# EAGLE design HarvestRing (EAGLE 6.5.0)
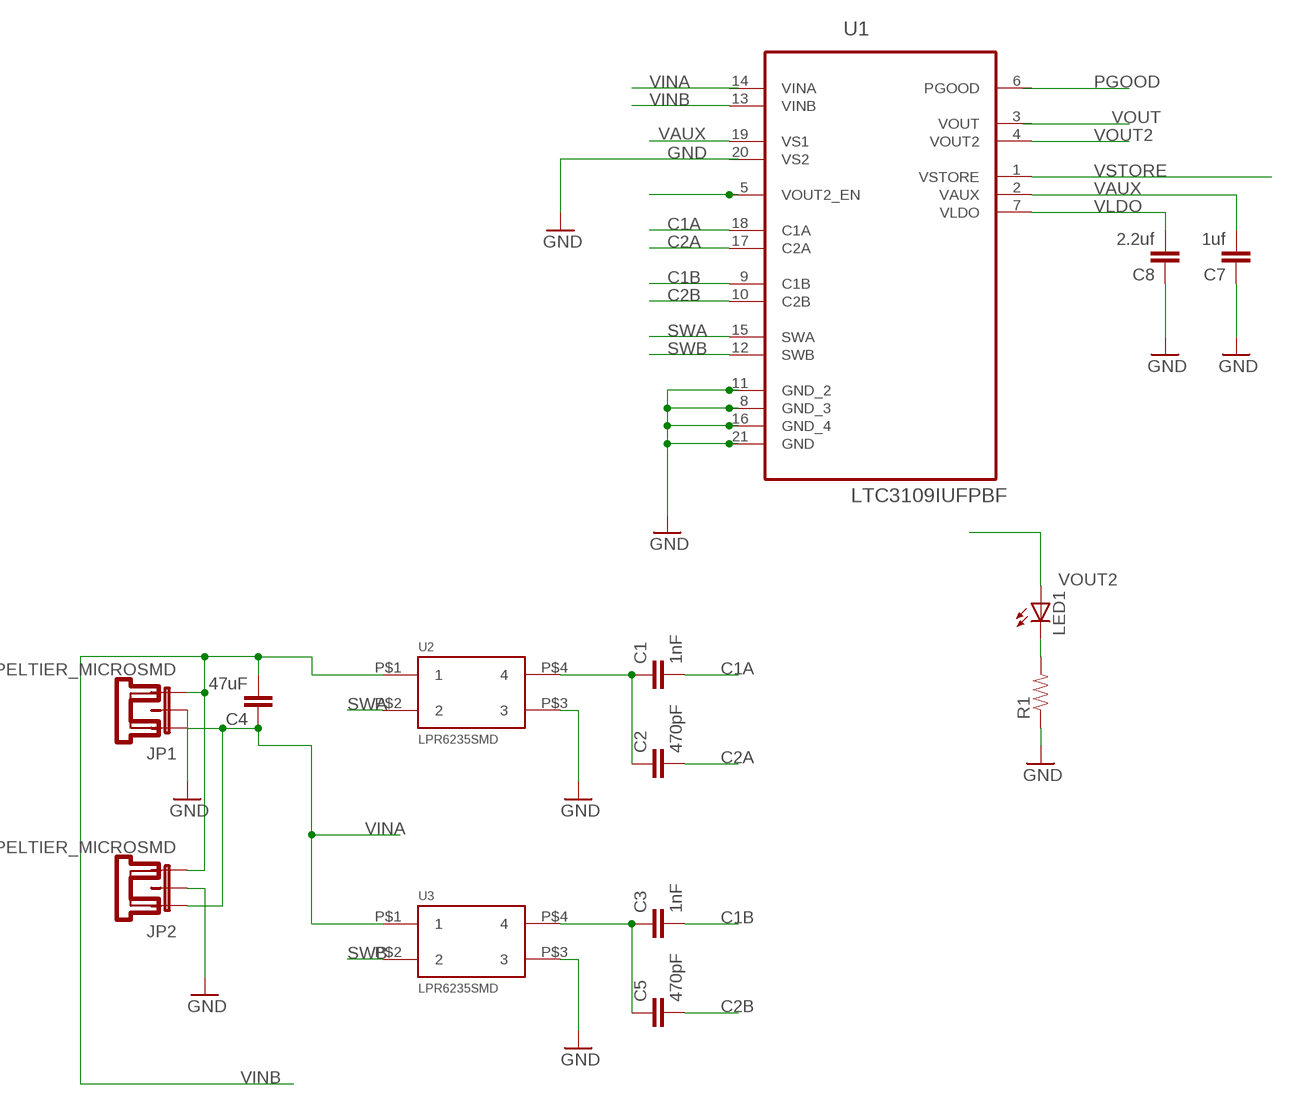
[diagram p0: schematic, sheet 1]

## Parts
C1  1nF  1NF/1000PF-50V-10%(0603)  [0603-CAP]
C2  470pF  22PF-50V-5%(0603)  [0603-CAP]
C3  1nF  1NF/1000PF-50V-10%(0603)  [0603-CAP]
C4  47uF  1NF/1000PF-50V-10%(0603)  [0603-CAP]
C5  470pF  22PF-50V-5%(0603)  [0603-CAP]
C7  1uf  1NF/1000PF-50V-10%(0603)  [0603-CAP]
C8  2.2uf  1NF/1000PF-50V-10%(0603)  [0603-CAP]
JP1  PELTIER_MICROSMD  [HV56]
JP2  PELTIER_MICROSMD  [HV56]
LED1  LED1206  [LED-1206]
R1  22K  22KOHM1/10W1%(0603)  [0603-RES]
U1  LTC3109IUFPBF  [QFN50P400X400X80-21N]
U2  LPR6235SMD  [LPR6235]
U3  LPR6235SMD  [LPR6235]

## Nets
C1A: C1.2 U1.18(C1A)
C1B: C3.2 U1.9(C1B)
C2A: C2.2 U1.17(C2A)
C2B: C5.2 U1.10(C2B)
GND: C7.1 C8.1 JP1.2 JP2.2 R1.1 U1.8(GND_3) U1.11(GND_2) U1.16(GND_4) U1.20(VS2) U1.21(GND) U2.P$3 U3.P$3
N$1: C1.1 C2.1 U2.P$4
N$3: LED1.C R1.2
N$4: C3.1 C5.1 U3.P$4
PGOOD: U1.5(VOUT2_EN) U1.6(PGOOD)
SWA: U1.15(SWA) U2.P$2
SWB: U1.12(SWB) U3.P$2
VAUX: C7.2 U1.2(VAUX) U1.19(VS1)
VINA: C4.1 JP1.1 JP2.1 U1.14(VINA) U3.P$1
VINB: C4.2 JP1.3 JP2.3 U1.13(VINB) U2.P$1
VLDO: C8.2 U1.7(VLDO)
VOUT: U1.3(VOUT)
VOUT2: LED1.A U1.4(VOUT2)
VSTORE: U1.1(VSTORE)

## Library data of the parts
C1 C3 = SparkFun-Capacitors:1NF/1000PF-50V-10%(0603): CAP-07886; PROD_ID: CAP-07886
C2 C5 = SparkFun-Capacitors:22PF-50V-5%(0603): CAP-07876; PROD_ID: CAP-07876; VALUE: 22pF
C4 C7 C8 = SparkFun-Capacitors:1NF/1000PF-50V-10%(0603): CAP-07886; PROD_ID: CAP-07886; VALUE: 1nF
JP1 JP2 = IdleHandsProject:PELTIER_MICRO
LED1 = anoven:LED: LEDs Standard schematic elements and footprints for 5mm, 3mm, 1210, 1206, and 0603 sized LEDs.
R1 = SparkFun-Resistors:22KOHM1/10W1%(0603): RES-07853; PROD_ID: RES-07853
U1 = LTC_By_element14_Batch_1:LTC3109IUFPBF: Auto-Polarity, Ultralow Voltage Step-Up Converter and Power Manager; MPN: LTC3109IUF#PBF; OC_FARNELL: 1839119; OC_NEWARK: 84R6678; PACKAGE: QFN-20; SUPPLIER: Linear Technology
U2 U3 = inductor-coilcraft-2:LPR6235: Miniature Step-Up Flyback Transformers – LPR6235 http://www.coilcraft.com/lpr6235.cfm

## Board
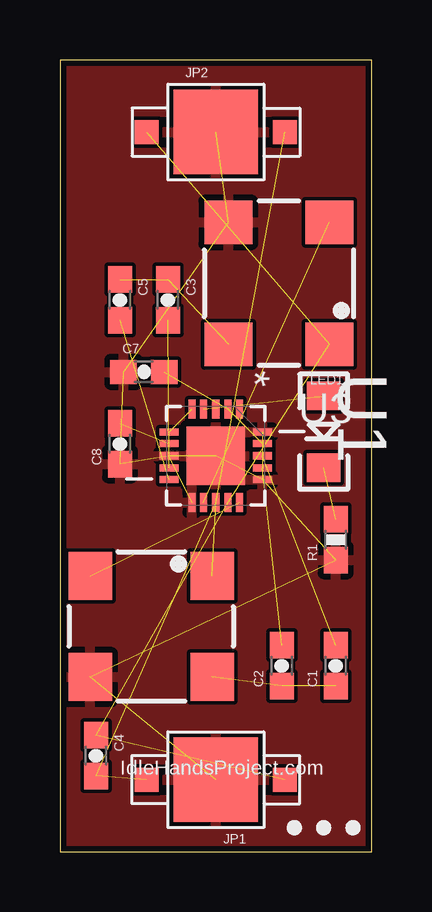
[diagram p1: board, top side]
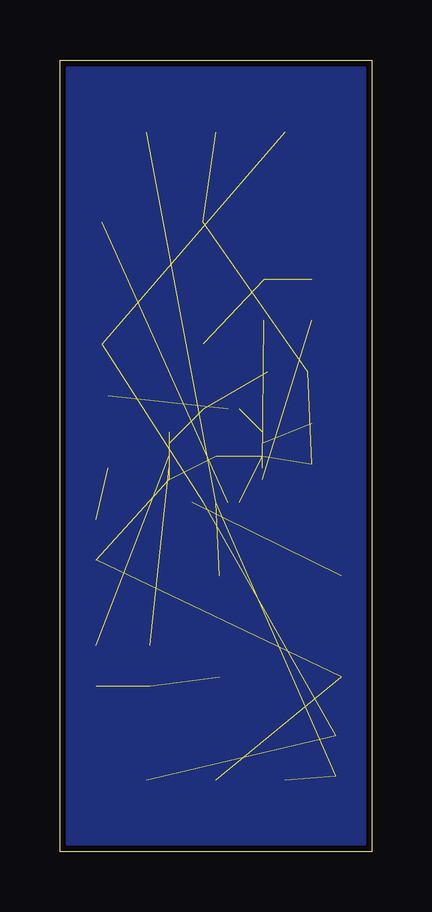
[diagram p2: board, bottom side, seen from below]

Size 13 x 33 mm. Coordinates in mm from the lower left corner, seen from the top.
Outline: 0,0 13,0 13,33 0,33 0,0
Copper layers (1*16): Top 0.0356mm / dielectric 1.5011mm / Bottom 0.0356mm
Design rules "LaenPCBOrder *": minimum track width 6mil, minimum drill 13mil, track to track 6mil, track to pad 6mil, pad to pad 6mil, via to via 6mil, smd to smd 6mil, copper to edge 10mil, drill to drill 6mil, minimum pad ring 7mil, minimum via ring 7mil, stop-mask expansion 3mil, vias tented up to drill 0mil, thermal gap 10mil

### Footprints (pad centres in the part's own frame; a part is rotated, then mirrored left to right if it is on the bottom)
0603-CAP = smd 1.1 x 1: 1 -0.85,0; 2 0.85,0
HV56 = smd 1 x 1: 1 -2.889,0; 3 2.889,0 | smd 3.54 x 3.54: 2 0,0
LED-1206 = smd 1.2 x 1.4: A -1.5,0; C 1.5,0
0603-RES = smd 1.1 x 1: 1 -0.85,0; 2 0.85,0
QFN50P400X400X80-21N = smd 0.787 x 0.305: 1 -1.956,0.991; 2 -1.956,0.508; 3 -1.956,0; 4 -1.956,-0.508; 5 -1.956,-0.991; 11 1.956,-0.991; 12 1.956,-0.508; 13 1.956,0; 14 1.956,0.508; 15 1.956,0.991 | smd 0.305 x 0.787: 6 -0.991,-1.956; 7 -0.508,-1.956; 8 0,-1.956; 9 0.508,-1.956; 10 0.991,-1.956; 16 0.991,1.956; 17 0.508,1.956; 18 0,1.956; 19 -0.508,1.956; 20 -0.991,1.956 | smd 2.438 x 2.438: 21 0,0
LPR6235 = smd 2 x 1.8: P$1 1.27,6.35; P$2 1.27,1.27; P$3 5.47,1.27; P$4 5.47,6.35

### Placement (x,y rotation side)
C1  11.5,7.75 90 top
C2  9.25,7.75 90 top
C3  4.5,23 270 top
C4  1.5,4 270 top
C5  2.5,23 270 top
C7  3.5,20 0 top
C8  2.5,17 90 top
JP1  6.5,3 180 top
JP2  6.5,30 0 top
LED1  11,17.5 270 top
R1  11.5,13 90 top
U1  6.5,16.5 270 top
U2  0,12.75 270 top
U3  12.5,27.5 180 top
U$1  [ELIPSISLOGO-3MM]  8.5,-1.6 0 top

### Tracks (layer width: path | path; a pad name or v marks a point on that pad's centre or on a via)
C1A  (1 unrouted)
C1B  (1 unrouted)
C2A  (1 unrouted)
C2B  (1 unrouted)
GND  (11 unrouted)
  pour Bottom: 0,0 0,33 13,33 13,0
  pour Top: 0,0 0,33 13,33 13,0
N$1  (2 unrouted)
N$3  (1 unrouted)
N$4  (2 unrouted)
PGOOD  (1 unrouted)
SWA  (1 unrouted)
SWB  (1 unrouted)
VAUX  (2 unrouted)
VINA  (4 unrouted)
VINB  (4 unrouted)
VLDO  (1 unrouted)
VOUT2  (1 unrouted)

### Text on the board
tPlace: IdleHandsProject.com